# Altium schematic sheet eHub.SchDoc
size A; SheetNumber: 1; SheetTotal: 5
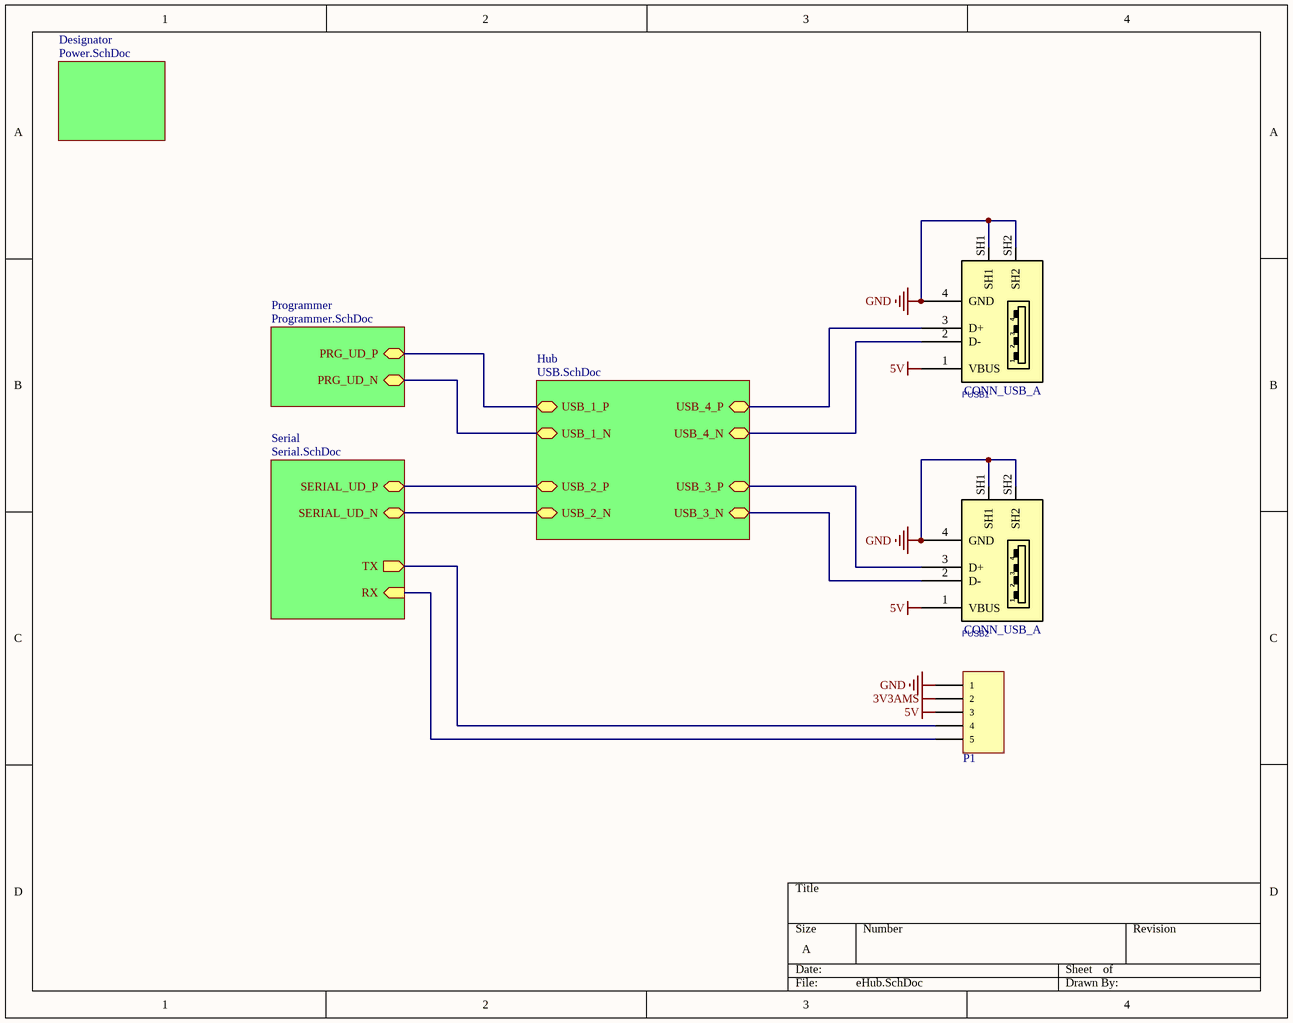
[diagram p0: eHub.SchDoc]

## Parts
P1  Header, 5-Pin  [HDR1X5]  (value not drawn)
PUSB1  CONN_USB_A  [USB_A_REC_RA_THD]
PUSB2  CONN_USB_A  [USB_A_REC_RA_THD]

## Sub-sheets
Designator = Power.SchDoc: no entries
Hub = USB.SchDoc: USB_4_P (bidir), USB_3_N (bidir), USB_2_P (bidir), USB_1_P (bidir), USB_3_P (bidir), USB_4_N (bidir), USB_2_N (bidir), USB_1_N (bidir)
Programmer = Programmer.SchDoc: PRG_UD_N (bidir), PRG_UD_P (bidir)
Serial = Serial.SchDoc: SERIAL_UD_N (bidir), TX (out), RX (in), SERIAL_UD_P (bidir)

## Nets
3V3AMS: P1.2
5V: P1.3 PUSB1.1(VBUS) PUSB2.1(VBUS)
GND: P1.1 PUSB1.4(GND) PUSB1.SH1 PUSB1.SH2 PUSB2.4(GND) PUSB2.SH1 PUSB2.SH2
NetP1_4: P1.4 ; sheet Serial/TX
NetP1_5: P1.5 ; sheet Serial/RX
NetPUSB1_2: PUSB1.2(D-) ; sheet Hub/USB_4_N
NetPUSB1_3: PUSB1.3(D+) ; sheet Hub/USB_4_P
NetPUSB2_2: PUSB2.2(D-) ; sheet Hub/USB_3_N
NetPUSB2_3: PUSB2.3(D+) ; sheet Hub/USB_3_P
(unnamed): sheet Programmer/PRG_UD_N, sheet Hub/USB_1_N
(unnamed): sheet Programmer/PRG_UD_P, sheet Hub/USB_1_P
(unnamed): sheet Serial/SERIAL_UD_N, sheet Hub/USB_2_N
(unnamed): sheet Serial/SERIAL_UD_P, sheet Hub/USB_2_P

## Library data of the parts
P1 = Header 5: LatestRevisionDate: 17-Jul-2002; LatestRevisionNote: Re-released for DXP Platform.; Publisher: Altium Limited
PUSB1 PUSB2 = CONN_USB_A_REC_RA_THD: CONN, USB, A, RECEPTACLE, R/A, THD; VALUE: CONN_USB_A